# EAGLE design GameBone (EAGLE 7.6.0)
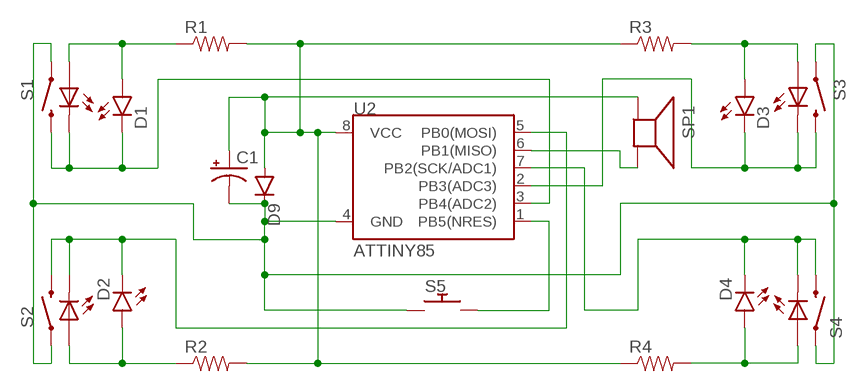
[diagram p0: schematic, sheet 1]

## Parts
C1  10UF-25V-20%(PTH)  [CPOL-RADIAL-10UF-25V]
D1  LED5MM  [LED5MM]
D2  LED5MM  [LED5MM]
D3  LED5MM  [LED5MM]
D4  LED5MM  [LED5MM]
D9  DIODEPTH  [DIODE-1N4001]
R1  RESISTORPTH-1/4W  [AXIAL-0.4]
R2  RESISTORPTH-1/4W  [AXIAL-0.4]
R3  RESISTORPTH-1/4W  [AXIAL-0.4]
R4  RESISTORPTH-1/4W  [AXIAL-0.4]
S1  SWITCH-MOMENTARY-LEDPTH  [TACTILE-PTH-LED-12MM]
S2  SWITCH-MOMENTARY-LEDPTH  [TACTILE-PTH-LED-12MM]
S3  SWITCH-MOMENTARY-LEDPTH  [TACTILE-PTH-LED-12MM]
S4  SWITCH-MOMENTARY-LEDPTH  [TACTILE-PTH-LED-12MM]
S5  SWITCH_PUSHBUTTONEVQ-PE  [TACT_PANA-EVQ]
SP1  SPEAKER/AL60P  [AL60P]
U2  ATTINY85  ATTINY45TINY85-20-DIP  [DIP08]

## Nets
N$1: C1.1(+) D9.A R1.P$2 R2.P$2 R3.P$1 R4.P$1 SP1.1(+) U2.8(VCC)
N$2: C1.2(-) D9.C S1.4 S2.4 S3.4 S4.4 S5.P$1 U2.4(GND)
N$3: SP1.2(-) U2.6(PB1(MISO))
N$4: D4.K(C) S4.2 S4.C U2.7(PB2(SCK/ADC1))
N$5: S5.P$2 U2.1(PB5(NRES))
N$6: D2.K(C) S2.2 S2.C U2.5(PB0(MOSI))
N$10: D1.K(C) S1.2 S1.C U2.3(PB4(ADC2))
N$12: D3.K(C) S3.2 S3.C U2.2(PB3(ADC3))
N$15: D2.A R2.P$1 S2.A
N$16: D1.A R1.P$1 S1.A
N$17: D3.A R3.P$2 S3.A
N$19: D4.A R4.P$2 S4.A

## Library data of the parts
C1 = SparkFun-Capacitors:10UF-25V-20%(PTH): CAP-08440; PROD_ID: CAP-08440
D1-D4 = SparkFun-LED:LED: LEDs Standard schematic elements and footprints for 5mm, 3mm, 1206, and 0603 sized LEDs. 5mm - Spark Fun Electronics SKU : COM-00529 (and others)
D9 = SparkFun-DiscreteSemi:DIODE: Diode These are standard reverse protection diodes and small signal diodes. SMA package can handle up to about 1A. SOD-323 can handle about 200mA. What the SOD-323 package when ordering, there are some mfgs out there that are 5-pin packages.
R1-R4 = SparkFun-Passives:RESISTOR: Resistor Basic schematic elements and footprints for 0603, 1206, and PTH resistors.
S1-S4 = SparkFun-Electromechanical:SWITCH-MOMENTARY-LED: EZ is for Kits. There is no tStop (covering up the top side of the pads with mask). This helps the beginner see which side they should be soldering too.
S5 = adafruit:SWITCH_PUSHBUTTON: Buttons SOFTTOUCHSMD_SJ - Soft touch temporary push button (Super Junk Akihabara) Compatible with SKPMANE010 [Mouser: 688-SKPMAN] C&K_KSS = Digikey: KSS221GLFS
SP1 = adafruit:SPEAKER: SPEAKER Source: Buerklin Added PS12 (for part # PS1240 piezo) http://www.ladyada.net/library/pcb/eaglelibrary.html
U2 = SparkFun-DigitalIC:ATTINY45: Atmel 8-pin 2/4/8kB flash uC; PROD_ID: IC-09445; VALUE: TINY85-20-DIP

## Board
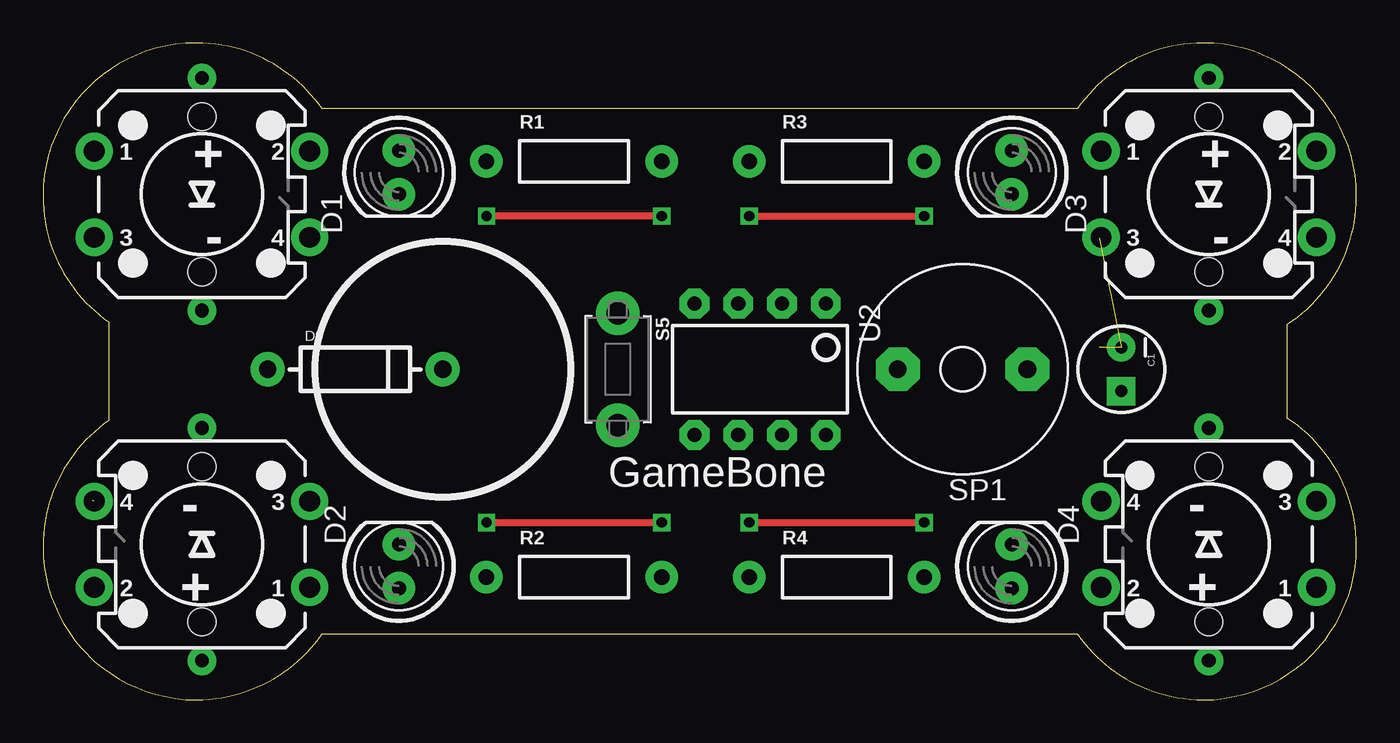
[diagram p1: board, top side]
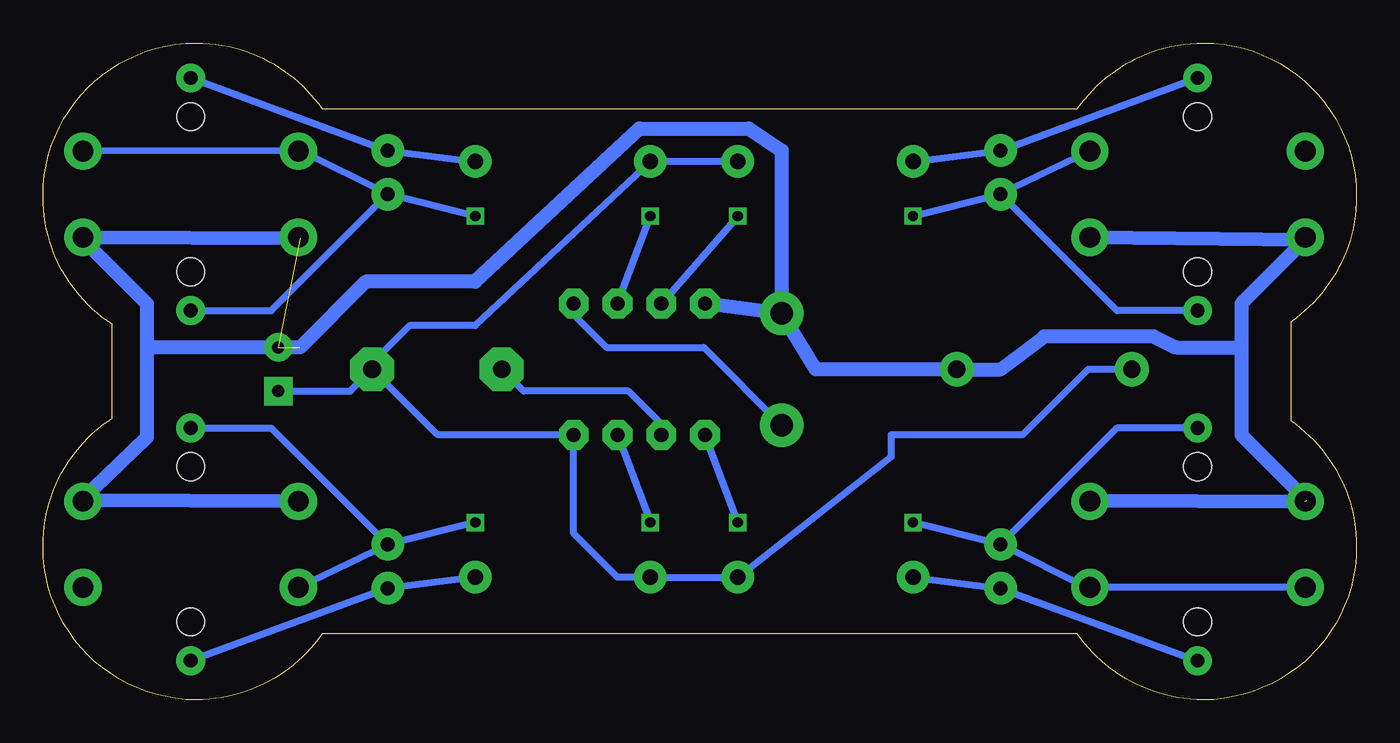
[diagram p2: board, bottom side, seen from below]

Size 76.2 x 38.1 mm. Coordinates in mm from the lower left corner, seen from the top.
Outline: 72.2,16.31 72.2,21.79 72.5,21.99 72.79,22.2 73.06,22.44 73.34,22.67 73.6,22.92 73.84,23.18 74.09,23.45 74.31,23.73 74.53,24.02 74.74,24.31 74.93,24.61 75.1,24.93 75.28,25.25 75.43,25.58 75.57,25.92 75.71,26.26 75.82,26.61 75.91,26.97 76.01,27.32 76.08,27.69 76.13,28.07 76.17,28.44 76.2,28.82 76.2,29.82 76.14,30.42 76.02,31 75.9,31.58 75.73,32.14 75.5,32.67 75.28,33.2 75,33.71 74.68,34.18 74.36,34.65 74,35.09 73.6,35.5 73.19,35.9 72.75,36.26 72.28,36.58 71.81,36.9 71.3,37.18 70.24,37.63 69.68,37.8 69.1,37.92 68.52,38.04 67.92,38.1 66.93,38.1 66.56,38.08 66.19,38.03 65.83,37.99 65.47,37.92 65.12,37.83 64.77,37.74 64.43,37.63 63.77,37.37 63.44,37.22 63.13,37.06 62.82,36.89 62.52,36.71 62.23,36.51 61.95,36.31 61.67,36.09 61.41,35.86 61.15,35.62 60.9,35.38 60.67,35.12 60.43,34.85 60.22,34.58 60.02,34.29 16.18,34.29 15.98,34.58 15.77,34.85 15.53,35.12 15.3,35.38 15.05,35.62 14.53,36.09 14.25,36.31 13.97,36.51 13.68,36.71 13.38,36.89 13.07,37.06 12.76,37.22 12.43,37.37 12.1,37.5 11.77,37.63 11.43,37.74 11.08,37.83 10.73,37.92 10.37,37.99 10,38.03 9.64,38.08 9.27,38.1 8.28,38.1 7.68,38.04 7.1,37.92 6.52,37.8 5.96,37.63 5.43,37.4 4.9,37.18 4.39,36.9 3.92,36.58 3.45,36.26 3.01,35.9 2.2,35.09 1.84,34.65 1.52,34.18 1.2,33.71 0.92,33.2 0.7,32.67 0.47,32.14 0.3,31.58 0.18,31 0.06,30.42 0,29.82 0,28.83 0.02,28.46 0.07,28.1 0.11,27.73 0.18,27.37 0.27,27.02 0.36,26.67 0.47,26.33 0.6,26 0.73,25.67 0.88,25.34 1.04,25.03 1.21,24.72 1.39,24.42 1.59,24.13 1.79,23.85 2.01,23.57 2.24,23.31 2.48,23.05 2.72,22.8 2.99,22.57 3.25,22.33 3.52,22.12 3.81,21.92 3.81,16.18 3.52,15.98 3.25,15.77 2.72,15.3 2.48,15.05 2.24,14.79 2.01,14.53 1.79,14.25 1.59,13.97 1.39,13.68 1.21,13.38 1.04,13.07 0.88,12.76 0.73,12.43 0.6,12.1 0.47,11.77 0.36,11.43 0.27,11.08 0.18,10.73 0.11,10.37 0.07,10 0.02,9.64 0,9.27 0,8.28 0.06,7.68 0.18,7.1 0.3,6.52 0.47,5.96 0.7,5.43 0.92,4.9 1.2,4.39 1.52,3.92 1.84,3.45 2.2,3.01 3.01,2.2 3.45,1.84 4.39,1.2 4.9,0.92 5.43,0.7 5.96,0.47 6.52,0.3 7.1,0.18 7.68,0.06 8.28,0 9.27,0 9.64,0.02 10,0.07 10.37,0.12 10.73,0.18 11.08,0.27 11.43,0.36 11.77,0.47 12.43,0.73 12.76,0.88 13.07,1.04 13.38,1.21 13.68,1.39 13.97,1.59 14.25,1.79 14.53,2.01 14.79,2.24 15.05,2.48 15.3,2.72 15.53,2.99 15.77,3.25 15.98,3.52 16.18,3.81 60.02,3.81 60.22,3.52 60.43,3.25 60.67,2.99 60.9,2.72 61.15,2.48 61.41,2.24 61.67,2.01 61.94,1.79 62.23,1.59 62.52,1.39 62.82,1.21 63.13,1.04 63.44,0.88 63.77,0.73 64.1,0.6 64.43,0.47 64.77,0.36 65.12,0.27 65.47,0.18 65.83,0.12 66.19,0.07 66.56,0.02 66.93,0 67.92,0 68.52,0.06 69.1,0.18 69.68,0.3 70.24,0.47 71.3,0.92 71.81,1.2 72.28,1.52 72.75,1.84 73.19,2.2 73.6,2.6 74,3.01 74.36,3.45 74.68,3.92 75,4.39 75.28,4.9 75.5,5.43 75.73,5.96 75.9,6.52 76.02,7.1 76.14,7.68 76.2,8.28 76.2,9.28 76.17,9.66 76.13,10.03 76.08,10.41 76.01,10.78 75.82,11.49 75.71,11.84 75.57,12.18 75.43,12.52 75.28,12.85 75.1,13.17 74.93,13.49 74.74,13.79 74.53,14.08 74.31,14.38 74.09,14.65 73.84,14.92 73.6,15.18 73.34,15.43 73.06,15.66 72.79,15.9 72.5,16.11 72.2,16.31
Copper layers (1*16): Top 0.035mm / dielectric 1.5mm / Bottom 0.035mm
Design rules "default": minimum track width 10mil, minimum drill 24mil, track to track 8mil, track to pad 8mil, pad to pad 8mil, via to via 8mil, smd to smd 8mil, copper to edge 40mil, drill to drill 8mil, minimum pad ring 10mil, minimum via ring 8mil, stop-mask expansion 4mil, vias tented up to drill 0mil, thermal gap 10mil

### Footprints (pad centres in the part's own frame; a part is rotated, then mirrored left to right if it is on the bottom)
CPOL-RADIAL-10UF-25V = drill 0.7 pad 1.651 square: 1 1.27,0 | drill 0.7 pad 1.651: 2 -1.27,0
LED5MM = drill 0.813 pad 1.88: A -1.27,0; K 1.27,0
DIODE-1N4001 = drill 1 pad 1.981: A -5.08,0; C 5.08,0
AXIAL-0.4 = drill 0.9 pad 1.88: P$1 -5.08,0; P$2 5.08,0
TACTILE-PTH-LED-12MM = drill 1.2 pad 2.159: 1 -6.25,2.5; 2 6.25,2.5; 3 -6.25,-2.5; 4 6.25,-2.5 | drill 0.8 pad 1.676: A 0,6.75; C 0,-6.75 | hole 1.6: 0,4.5; 0,-4.5
TACT_PANA-EVQ = drill 1.3 pad 2.54: P$1 -3.25,0; P$2 3.25,0
AL60P = drill 1.016 pad 2.54 octagon: 1 -3.759,0; 2 3.759,0
DIP08 = drill 0.813 pad 1.727 octagon: 1 -3.81,-3.81; 2 -1.27,-3.81; 3 1.27,-3.81; 4 3.81,-3.81; 5 3.81,3.81; 6 1.27,3.81; 7 -1.27,3.81; 8 -3.81,3.81

### Placement (x,y rotation side)
C1  62.56,19.17 270 top
D1  20.65,30.6 270 top
D2  20.65,7.74 90 top
D3  56.21,30.6 270 top
D4  56.21,7.74 90 top
D9  18.11,19.17 0 top
R1  30.81,31.23 0 top
R2  30.81,7.1 0 top
R3  46.05,31.23 0 top
R4  46.05,7.1 0 top
S1  9.22,29.33 0 top
S2  9.22,9.01 180 top
S3  67.64,29.33 0 top
S4  67.64,9.01 180 top
S5  33.35,19.17 270 top
SP1  53.35,19.17 180 top
U2  41.6,19.17 180 top

### Tracks (layer width: path | path; a pad name or v marks a point on that pad's centre or on a via)
N$1
  Bottom 0.406: R1.P$2 R3.P$1 51.13,21.71 54.94,21.71 57.11,19.53 SP1.1 | D9.A 15.57,19.17 19.38,15.36 27,15.36 27,14.09 R2.P$2 R4.P$1 42.87,7.1 45.41,9.64 U2.8 53.3,15.36 SP1.1 | C1.1 58.38,17.9 SP1.1
N$2  (3 unrouted)
  Bottom 0.406: 33.03,21.9 S5.P$1 | U2.4 37.72,22.98 | 73.95,26.83 73.99,26.79
  Bottom 0.8: 33.03,21.9 31.37,19.17 D9.C 20.65,19.17 18.11,21.07 11.76,21.07 | 2.97,26.69 6.68,22.98 6.68,20.44 | 6.68,20.44 6.68,15.36 2.87,11.55 | 70.18,22.98 70.18,20.44 | 70.18,20.44 70.18,15.22 | 70.18,20.44 61.29,20.44 57.48,24.25 51.13,24.25 41.6,33.14 35.25,33.14 33.35,31.87 S5.P$1 U2.4 | 10.49,20.44 6.68,20.44
  Bottom 0.813: 11.76,21.07 10.49,20.44 | S4.4 73.99,11.55 70.18,15.22 | 73.99,26.79 70.18,22.98 | S1.4 2.97,26.69 | 15.43,11.55 S2.4 | 73.95,26.83 61.29,26.79
N$3
  Bottom 0.406: U2.6 40.33,15.99 42.24,17.9 48.32,17.9 SP1.2
N$4  (via drill 0.6)
  Top 0.406: v40.97,10.28 v51.13,10.28
  Bottom 0.406: U2.7 v40.97,10.28 | v51.13,10.28 D4.K | D4.K 62.96,15.76 S4.C | S4.2 D4.K
N$5
  Bottom 0.406: U2.1 45.41,22.34 43.51,20.44 37.87,20.44 S5.P$2
N$6  (via drill 0.6)
  Top 0.406: v25.73,10.28 v35.89,10.28
  Bottom 0.406: D2.K v25.73,10.28 | v35.89,10.28 U2.5 | S2.C 13.9,15.76 D2.K | S2.2 15.53,6.51 15.57,6.47 D2.K
N$10  (via drill 0.6)
  Top 0.406: v35.89,28.06 v25.73,28.06
  Bottom 0.406: U2.3 v35.89,28.06 | v25.73,28.06 D1.K | S1.C 13.9,22.58 D1.K | S1.2 D1.K
N$12  (via drill 0.6)
  Top 0.406: v40.97,28.06 v51.13,28.06
  Bottom 0.406: U2.2 v40.97,28.06 | v51.13,28.06 D3.K | D3.K 61.29,31.87 S3.2 | S3.C 62.96,22.58 D3.K
N$15
  Bottom 0.406: R2.P$1 D2.A S2.A
N$16
  Bottom 0.406: R1.P$1 D1.A S1.A
N$17
  Bottom 0.406: S3.A D3.A R3.P$2
N$19
  Bottom 0.406: R4.P$2 D4.A S4.A

### Text on the board
tPlace: GameBone